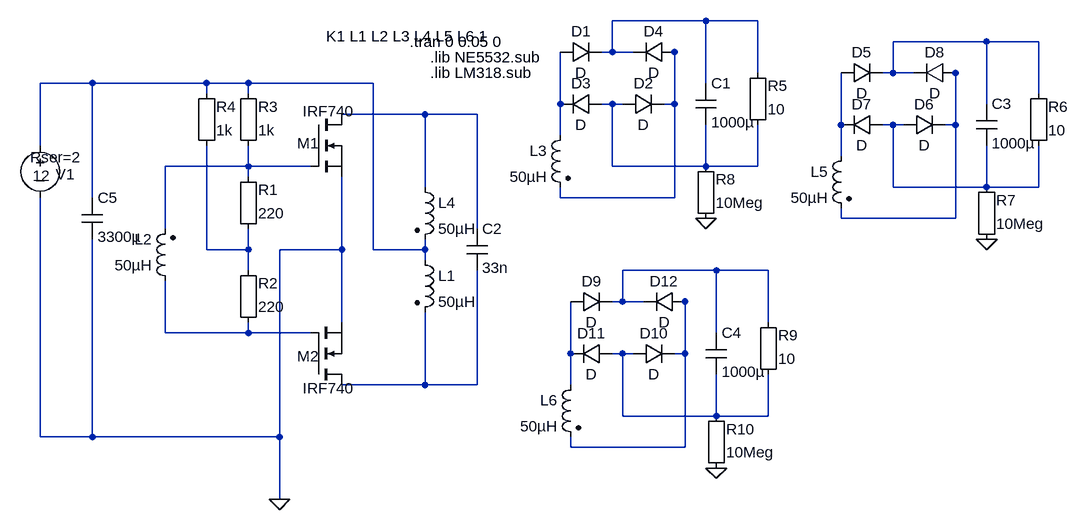
[diagram p0: schematic multi_5v.asc]
multi_5v.asc, the LTspice schematic file:
Version 4
SHEET 1 1228 680
WIRE -1056 -608 -1200 -608
WIRE -976 -608 -1056 -608
WIRE -624 -576 -768 -576
WIRE -544 -576 -624 -576
WIRE -1200 -560 -1200 -608
WIRE -1200 -560 -1216 -560
WIRE -1168 -560 -1200 -560
WIRE -1104 -560 -1120 -560
WIRE -976 -528 -976 -608
WIRE -768 -528 -768 -576
WIRE -768 -528 -784 -528
WIRE -736 -528 -768 -528
WIRE -672 -528 -688 -528
WIRE -2000 -512 -2080 -512
WIRE -1824 -512 -2000 -512
WIRE -1760 -512 -1824 -512
WIRE -1568 -512 -1760 -512
WIRE -1056 -512 -1056 -608
WIRE -1824 -496 -1824 -512
WIRE -1760 -496 -1760 -512
WIRE -544 -496 -544 -576
WIRE -1280 -480 -1280 -560
WIRE -1200 -480 -1216 -480
WIRE -1184 -480 -1200 -480
WIRE -1104 -480 -1104 -560
WIRE -1104 -480 -1120 -480
WIRE -624 -480 -624 -576
WIRE -1488 -464 -1616 -464
WIRE -1408 -464 -1488 -464
WIRE -848 -448 -848 -528
WIRE -768 -448 -784 -448
WIRE -752 -448 -768 -448
WIRE -672 -448 -672 -528
WIRE -672 -448 -688 -448
WIRE -1280 -432 -1280 -480
WIRE -2080 -416 -2080 -512
WIRE -848 -400 -848 -448
WIRE -1760 -384 -1760 -416
WIRE -1760 -384 -1888 -384
WIRE -1664 -384 -1760 -384
WIRE -1200 -384 -1200 -480
WIRE -1056 -384 -1056 -448
WIRE -1056 -384 -1200 -384
WIRE -976 -384 -976 -448
WIRE -976 -384 -1056 -384
WIRE -1760 -368 -1760 -384
WIRE -1488 -352 -1488 -464
WIRE -768 -352 -768 -448
WIRE -624 -352 -624 -416
WIRE -624 -352 -768 -352
WIRE -544 -352 -544 -416
WIRE -544 -352 -624 -352
WIRE -2000 -336 -2000 -512
WIRE -1280 -336 -1280 -352
WIRE -1104 -336 -1104 -480
WIRE -1104 -336 -1280 -336
WIRE -848 -304 -848 -320
WIRE -672 -304 -672 -448
WIRE -672 -304 -848 -304
WIRE -1888 -288 -1888 -384
WIRE -1408 -288 -1408 -464
WIRE -1824 -256 -1824 -416
WIRE -1760 -256 -1760 -288
WIRE -1760 -256 -1824 -256
WIRE -1616 -256 -1616 -368
WIRE -1616 -256 -1712 -256
WIRE -1568 -256 -1568 -512
WIRE -1488 -256 -1488 -272
WIRE -1488 -256 -1568 -256
WIRE -1488 -240 -1488 -256
WIRE -1760 -224 -1760 -256
WIRE -1040 -224 -1184 -224
WIRE -960 -224 -1040 -224
WIRE -1184 -176 -1184 -224
WIRE -1184 -176 -1200 -176
WIRE -1152 -176 -1184 -176
WIRE -1088 -176 -1104 -176
WIRE -1616 -144 -1616 -256
WIRE -960 -144 -960 -224
WIRE -1888 -128 -1888 -208
WIRE -1760 -128 -1760 -144
WIRE -1760 -128 -1888 -128
WIRE -1664 -128 -1760 -128
WIRE -1040 -128 -1040 -224
WIRE -1264 -96 -1264 -176
WIRE -1184 -96 -1200 -96
WIRE -1168 -96 -1184 -96
WIRE -1088 -96 -1088 -176
WIRE -1088 -96 -1104 -96
WIRE -1488 -48 -1488 -160
WIRE -1488 -48 -1616 -48
WIRE -1408 -48 -1408 -224
WIRE -1408 -48 -1488 -48
WIRE -1264 -48 -1264 -96
WIRE -1184 0 -1184 -96
WIRE -1040 0 -1040 -64
WIRE -1040 0 -1184 0
WIRE -960 0 -960 -64
WIRE -960 0 -1040 0
WIRE -2080 32 -2080 -336
WIRE -2000 32 -2000 -272
WIRE -2000 32 -2080 32
WIRE -1712 32 -1712 -256
WIRE -1712 32 -2000 32
WIRE -1264 48 -1264 32
WIRE -1088 48 -1088 -96
WIRE -1088 48 -1264 48
WIRE -1712 128 -1712 32
FLAG -1712 128 0
FLAG -1056 -304 0
FLAG -624 -272 0
FLAG -1040 80 0
SYMBOL voltage -2080 -432 M0
WINDOW 123 0 0 Left 2
WINDOW 39 -63 34 Left 2
WINDOW 0 -53 60 Left 2
WINDOW 3 -15 62 Left 2
SYMATTR SpiceLine Rser=2
SYMATTR InstName V1
SYMATTR Value 12
SYMBOL ind2 -1504 -256 R0
SYMATTR InstName L1
SYMATTR Value 50µH
SYMATTR SpiceLine Rser=.1 Cpar=50p
SYMATTR Type ind
SYMBOL nmos -1664 -464 R0
WINDOW 0 -21 44 Left 2
WINDOW 3 -12 -5 Left 2
SYMATTR InstName M1
SYMATTR Value IRF740
SYMBOL nmos -1664 -48 M180
WINDOW 0 -21 44 Left 2
WINDOW 3 -12 -5 Left 2
SYMATTR InstName M2
SYMATTR Value IRF740
SYMBOL Misc\\EuropeanResistor -1776 -272 M180
WINDOW 0 31 76 Left 2
WINDOW 3 31 40 Left 2
SYMATTR InstName R1
SYMATTR Value 220
SYMBOL Misc\\EuropeanResistor -1776 -128 M180
WINDOW 0 31 76 Left 2
WINDOW 3 31 40 Left 2
SYMATTR InstName R2
SYMATTR Value 220
SYMBOL Misc\\EuropeanResistor -1776 -400 M180
WINDOW 0 31 76 Left 2
WINDOW 3 31 40 Left 2
SYMATTR InstName R3
SYMATTR Value 1k
SYMBOL Misc\\EuropeanResistor -1840 -400 M180
WINDOW 0 31 76 Left 2
WINDOW 3 31 40 Left 2
SYMATTR InstName R4
SYMATTR Value 1k
SYMBOL ind2 -1872 -192 R180
WINDOW 0 36 80 Left 2
WINDOW 3 36 40 Left 2
SYMATTR InstName L2
SYMATTR Value 50µH
SYMATTR SpiceLine Rser=.1 Cpar=50p
SYMATTR Type ind
SYMBOL ind2 -1264 -448 M0
SYMATTR InstName L3
SYMATTR Value 50µH
SYMATTR SpiceLine Rser=.1 Cpar=50p
SYMATTR Type ind
SYMBOL Misc\\EuropeanCap -1072 -448 M180
WINDOW 0 24 64 Left 2
WINDOW 3 24 4 Left 2
SYMATTR InstName C1
SYMATTR Value 1000µ
SYMATTR SpiceLine V=400 Irms=1 Rser=.32 Lser=0
SYMBOL diode -1280 -544 R270
WINDOW 0 32 32 VTop 2
WINDOW 3 0 32 VBottom 2
SYMATTR InstName D1
SYMBOL diode -1184 -464 R270
WINDOW 0 32 32 VTop 2
WINDOW 3 0 32 VBottom 2
SYMATTR InstName D2
SYMBOL diode -1216 -496 R90
WINDOW 0 0 32 VBottom 2
WINDOW 3 32 32 VTop 2
SYMATTR InstName D3
SYMBOL diode -1104 -576 R90
WINDOW 0 0 32 VBottom 2
WINDOW 3 32 32 VTop 2
SYMATTR InstName D4
SYMBOL Misc\\EuropeanResistor -992 -432 M180
WINDOW 0 31 76 Left 2
WINDOW 3 31 40 Left 2
SYMATTR InstName R5
SYMATTR Value 10
SYMBOL ind2 -1504 -368 R0
SYMATTR InstName L4
SYMATTR Value 50µH
SYMATTR SpiceLine Rser=.1 Cpar=50p
SYMATTR Type ind
SYMBOL Misc\\EuropeanCap -1424 -224 M180
WINDOW 0 24 64 Left 2
WINDOW 3 24 4 Left 2
SYMATTR InstName C2
SYMATTR Value 33n
SYMATTR SpiceLine V=400 Irms=1 Rser=.32 Lser=0
SYMBOL Misc\\EuropeanResistor -1072 -288 M180
WINDOW 0 31 76 Left 2
WINDOW 3 31 40 Left 2
SYMATTR InstName R8
SYMATTR Value 10Meg
SYMBOL ind2 -832 -416 M0
SYMATTR InstName L5
SYMATTR Value 50µH
SYMATTR SpiceLine Rser=.1 Cpar=50p
SYMATTR Type ind
SYMBOL Misc\\EuropeanCap -640 -416 M180
WINDOW 0 24 64 Left 2
WINDOW 3 24 4 Left 2
SYMATTR InstName C3
SYMATTR Value 1000µ
SYMATTR SpiceLine V=400 Irms=1 Rser=.32 Lser=0
SYMBOL diode -848 -512 R270
WINDOW 0 32 32 VTop 2
WINDOW 3 0 32 VBottom 2
SYMATTR InstName D5
SYMBOL diode -752 -432 R270
WINDOW 0 32 32 VTop 2
WINDOW 3 0 32 VBottom 2
SYMATTR InstName D6
SYMBOL diode -784 -464 R90
WINDOW 0 0 32 VBottom 2
WINDOW 3 32 32 VTop 2
SYMATTR InstName D7
SYMBOL diode -672 -544 R90
WINDOW 0 0 32 VBottom 2
WINDOW 3 32 32 VTop 2
SYMATTR InstName D8
SYMBOL Misc\\EuropeanResistor -560 -400 M180
WINDOW 0 31 76 Left 2
WINDOW 3 31 40 Left 2
SYMATTR InstName R6
SYMATTR Value 10
SYMBOL Misc\\EuropeanResistor -640 -256 M180
WINDOW 0 31 76 Left 2
WINDOW 3 31 40 Left 2
SYMATTR InstName R7
SYMATTR Value 10Meg
SYMBOL ind2 -1248 -64 M0
SYMATTR InstName L6
SYMATTR Value 50µH
SYMATTR SpiceLine Rser=.1 Cpar=50p
SYMATTR Type ind
SYMBOL Misc\\EuropeanCap -1056 -64 M180
WINDOW 0 24 64 Left 2
WINDOW 3 24 4 Left 2
SYMATTR InstName C4
SYMATTR Value 1000µ
SYMATTR SpiceLine V=400 Irms=1 Rser=.32 Lser=0
SYMBOL diode -1264 -160 R270
WINDOW 0 32 32 VTop 2
WINDOW 3 0 32 VBottom 2
SYMATTR InstName D9
SYMBOL diode -1168 -80 R270
WINDOW 0 32 32 VTop 2
WINDOW 3 0 32 VBottom 2
SYMATTR InstName D10
SYMBOL diode -1200 -112 R90
WINDOW 0 0 32 VBottom 2
WINDOW 3 32 32 VTop 2
SYMATTR InstName D11
SYMBOL diode -1088 -192 R90
WINDOW 0 0 32 VBottom 2
WINDOW 3 32 32 VTop 2
SYMATTR InstName D12
SYMBOL Misc\\EuropeanResistor -976 -48 M180
WINDOW 0 31 76 Left 2
WINDOW 3 31 40 Left 2
SYMATTR InstName R9
SYMATTR Value 10
SYMBOL Misc\\EuropeanResistor -1056 96 M180
WINDOW 0 31 76 Left 2
WINDOW 3 31 40 Left 2
SYMATTR InstName R10
SYMATTR Value 10Meg
SYMBOL Misc\\EuropeanCap -2016 -272 M180
WINDOW 0 24 64 Left 2
WINDOW 3 24 4 Left 2
SYMATTR InstName C5
SYMATTR Value 3300µ
SYMATTR SpiceLine V=400 Irms=1 Rser=.32 Lser=0
TEXT -1640 -584 Left 2 !K1 L1 L2 L3 L4 L5 L6 1
TEXT -1512 -576 Left 2 !.tran 0 0.05 0
TEXT -1480 -552 Left 2 !.lib NE5532.sub
TEXT -1480 -528 Left 2 !.lib LM318.sub

The netlist it stands for:
* multi_5v.asc
V1 N005 0 12 Rser=2
L1 N005 N018 50µH Rser=.1 Cpar=50p
M1 N008 N011 0 0 IRF740
M2 N018 N015 0 0 IRF740
R1 N012 N011 220
R2 N015 N012 220
R3 N011 N005 1k
R4 N012 N005 1k
L2 N015 N011 50µH Rser=.1 Cpar=50p
L3 N006 N003 50µH Rser=.1 Cpar=50p
C1 N007 N001 1000µ V=400 Irms=1 Rser=.32 Lser=0
D1 N006 N001 D
D2 N007 N003 D
D3 N007 N006 D
D4 N003 N001 D
R5 N007 N001 10
L4 N008 N005 50µH Rser=.1 Cpar=50p
C2 N018 N008 33n V=400 Irms=1 Rser=.32 Lser=0
R8 0 N007 10Meg
L5 N009 N004 50µH Rser=.1 Cpar=50p
C3 N010 N002 1000µ V=400 Irms=1 Rser=.32 Lser=0
D5 N009 N002 D
D6 N010 N004 D
D7 N010 N009 D
D8 N004 N002 D
R6 N010 N002 10
R7 0 N010 10Meg
L6 N016 N014 50µH Rser=.1 Cpar=50p
C4 N017 N013 1000µ V=400 Irms=1 Rser=.32 Lser=0
D9 N016 N013 D
D10 N017 N014 D
D11 N017 N016 D
D12 N014 N013 D
R9 N017 N013 10
R10 0 N017 10Meg
C5 0 N005 3300µ V=400 Irms=1 Rser=.32 Lser=0
.model D D
.lib standard.dio
.model NMOS NMOS
.model PMOS PMOS
.lib standard.mos
K1 L1 L2 L3 L4 L5 L6 1
.tran 0 0.05 0
.lib NE5532.sub
.lib LM318.sub
.backanno
.end